# EasyEDA schematic hextech-mechahand.json
TITLE: 6 PID Driver; REV: 1.0; Date: 2019-07-25; Sheet: 1/1; Drawn By: Calin; Company: Motarelu
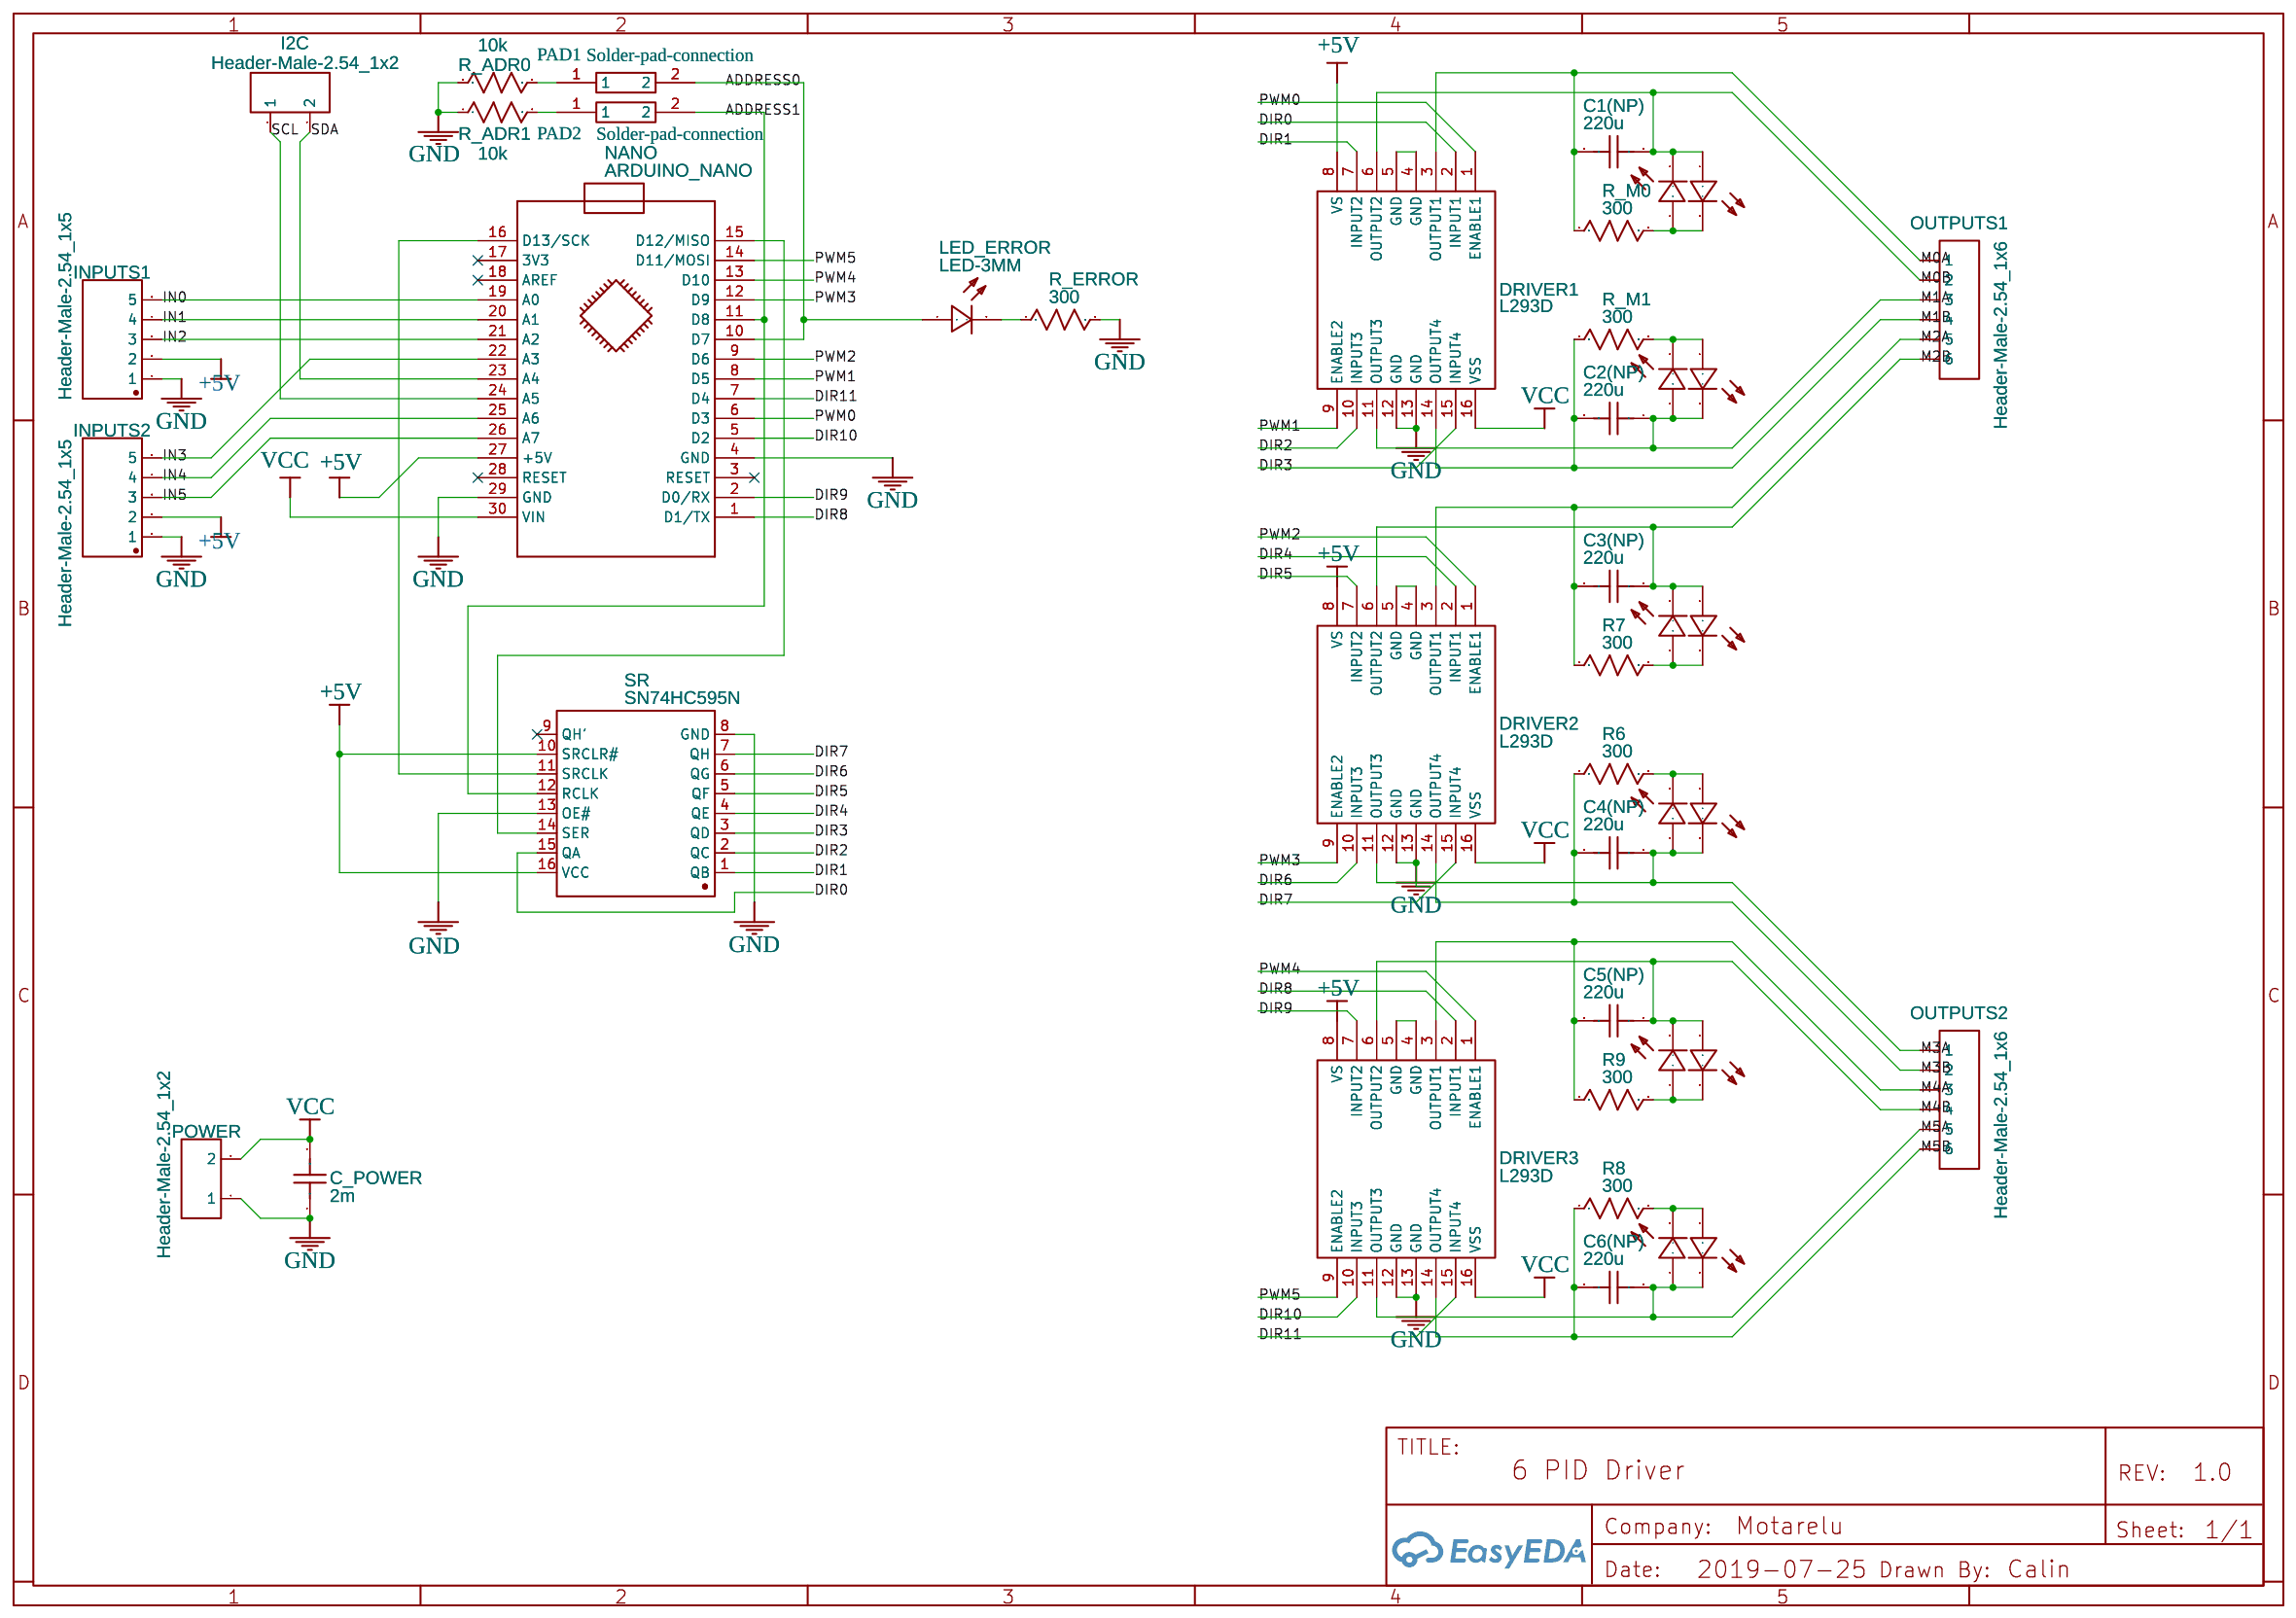
[diagram p0: schematic sheet]

## Parts
C1(NP)  220u  [RAD-0.1]
C2(NP)  220u  [RAD-0.1]
C3(NP)  220u  [RAD-0.1]
C4(NP)  220u  [RAD-0.1]
C5(NP)  220u  [RAD-0.1]
C6(NP)  220u  [RAD-0.1]
C_POWER  2m  [RAD-0.1]
DRIVER1  L293D  [DIP-16]
DRIVER2  L293D  [DIP-16]
DRIVER3  L293D  [DIP-16]
I2C  Header-Male-2.54_1x2  [HDR-2X1/2.54]
INPUTS1  Header-Male-2.54_1x5  [DIP-1X5P-2.54MM-M]
INPUTS2  Header-Male-2.54_1x5  [DIP-1X5P-2.54MM-M]
LED_ERROR  LED-3MM  [LED-3MM/2.54]
LED_M0A  LED-3MM  [LED-3MM/2.54]
LED_M0B  LED-3MM  [LED-3MM/2.54]
LED_M1A  LED-3MM  [LED-3MM/2.54]
LED_M1B  LED-3MM  [LED-3MM/2.54]
LED_M2A  LED-3MM  [LED-3MM/2.54]
LED_M2B  LED-3MM  [LED-3MM/2.54]
LED_M3A  LED-3MM  [LED-3MM/2.54]
LED_M3B  LED-3MM  [LED-3MM/2.54]
LED_M4A  LED-3MM  [LED-3MM/2.54]
LED_M4B  LED-3MM  [LED-3MM/2.54]
LED_M5A  LED-3MM  [LED-3MM/2.54]
LED_M5B  LED-3MM  [LED-3MM/2.54]
NANO  ARDUINO_NANO  [ARDUINO_NANO]
OUTPUTS1  Header-Male-2.54_1x6  [HDR-6X1/2.54]
OUTPUTS2  Header-Male-2.54_1x6  [HDR-6X1/2.54]
PAD1  Solder-pad-connection  [PAD SHUNT]
PAD2  Solder-pad-connection  [PAD SHUNT]
POWER  Header-Male-2.54_1x2  [HDR-2X1/2.54]
R6  300  [AXIAL-0.3]
R7  300  [AXIAL-0.3]
R8  300  [AXIAL-0.3]
R9  300  [AXIAL-0.3]
R_ADR0  10k  [AXIAL-0.3]
R_ADR1  10k  [AXIAL-0.3]
R_ERROR  300  [AXIAL-0.3]
R_M0  300  [AXIAL-0.3]
R_M1  300  [AXIAL-0.3]
SR  SN74HC595N  [DIP-16]

## Library data of the parts
C1(NP) C2(NP) C3(NP) C4(NP) C5(NP) C6(NP) C_POWER = Cap_RAD-0.1_US: Manufacturer Part: ?
DRIVER1-DRIVER3 = -: Contributor: pitreluc; Supplier: LCSC; Manufacturer: STMicroelectronics; image: //image.lceda.cn/szlcsc/C12340.jpg; Supplier Part: C12340
I2C POWER = -: Supplier: LCSC; Manufacturer: TE Connectivity; Manufacturer Part: 826629-2; image: //image.lceda.cn/szlcsc/C86471.jpg; Supplier Part: C86471
INPUTS1 INPUTS2 = -: Supplier: LCSC; Manufacturer: Ckmtw; Manufacturer Part: 210S-1*5P L=11.6MMGold-plated black; Contributor: LCSC; Supplier Part: C124379
LED_ERROR LED_M0A LED_M0B LED_M1A LED_M1B LED_M2A LED_M2B LED_M3A LED_M3B LED_M4A LED_M4B LED_M5A LED_M5B = -: Supplier: LCSC; Manufacturer: EVERLIGHT; Manufacturer Part: 204-10SURD/S530-A3; Supplier Part: C99772
NANO = -: sourceId: KGSeAWhDB; Manufacturer Part: ?
OUTPUTS1 OUTPUTS2 = -: Supplier: LCSC; Manufacturer: BOOMELE; Supplier Part: C37208
R6-R9 R_ADR0 R_ADR1 R_ERROR R_M0 R_M1 = Res_AXIAL-0.3(1/8W)_US: Manufacturer Part: ?
SR = -: Supplier: LCSC; Manufacturer: TI; image: //image.lceda.cn/szlcsc/C78711.jpg; Supplier Part: C78711

## Nets
+5V: DRIVER1.8(VS) DRIVER2.8(VS) DRIVER3.8(VS) INPUTS1.2 INPUTS2.2 NANO.27(+5V) SR.10(SRCLR#) SR.16(VCC)
GND: C_POWER.1 DRIVER1.12(GND) DRIVER1.13(GND) DRIVER2.12(GND) DRIVER2.13(GND) DRIVER3.12(GND) DRIVER3.13(GND) INPUTS1.1 INPUTS2.1 NANO.4(GND) NANO.29(GND) POWER.1 R_ADR0.1 R_ADR1.1 R_ERROR.2 SR.8(GND) SR.13(OE#)
VCC: C_POWER.2 DRIVER1.16(VSS) DRIVER2.16(VSS) DRIVER3.16(VSS) NANO.30(VIN) POWER.2
ADDRESS0: LED_ERROR.1(+) NANO.10(D7) PAD1.2
ADDRESS1: NANO.11(D8) PAD2.2 SR.12(RCLK)
DIR0: DRIVER1.2(INPUT1) SR.15(QA)
DIR1: DRIVER1.7(INPUT2) SR.1(QB)
DIR2: DRIVER1.10(INPUT3) SR.2(QC)
DIR3: DRIVER1.15(INPUT4) SR.3(QD)
DIR4: DRIVER2.2(INPUT1) SR.4(QE)
DIR5: DRIVER2.7(INPUT2) SR.5(QF)
DIR6: DRIVER2.10(INPUT3) SR.6(QG)
DIR7: DRIVER2.15(INPUT4) SR.7(QH)
DIR8: DRIVER3.2(INPUT1) NANO.1(D1/TX)
DIR9: DRIVER3.7(INPUT2) NANO.2(D0/RX)
DIR10: DRIVER3.10(INPUT3) NANO.5(D2)
DIR11: DRIVER3.15(INPUT4) NANO.7(D4)
IN0: INPUTS1.5 NANO.19(A0)
IN1: INPUTS1.4 NANO.20(A1)
IN2: INPUTS1.3 NANO.21(A2)
IN3: INPUTS2.5 NANO.22(A3)
IN4: INPUTS2.4 NANO.25(A6)
IN5: INPUTS2.3 NANO.26(A7)
M0A: C1(NP).2 DRIVER1.3(OUTPUT1) OUTPUTS1.1 R_M0.1
M0B: C1(NP).1 DRIVER1.6(OUTPUT2) LED_M0A.2(-) LED_M0B.1(+) OUTPUTS1.2
M1A: C2(NP).1 DRIVER1.11(OUTPUT3) LED_M1A.1(+) LED_M1B.2(-) OUTPUTS1.3
M1B: C2(NP).2 DRIVER1.14(OUTPUT4) OUTPUTS1.4 R_M1.1
M2A: C3(NP).2 DRIVER2.3(OUTPUT1) OUTPUTS1.5 R7.1
M2B: C3(NP).1 DRIVER2.6(OUTPUT2) LED_M2A.2(-) LED_M2B.1(+) OUTPUTS1.6
M3A: C4(NP).1 DRIVER2.11(OUTPUT3) LED_M3A.1(+) LED_M3B.2(-) OUTPUTS2.1
M3B: C4(NP).2 DRIVER2.14(OUTPUT4) OUTPUTS2.2 R6.1
M4A: C5(NP).2 DRIVER3.3(OUTPUT1) OUTPUTS2.3 R9.1
M4B: C5(NP).1 DRIVER3.6(OUTPUT2) LED_M4A.2(-) LED_M4B.1(+) OUTPUTS2.4
M5A: C6(NP).1 DRIVER3.11(OUTPUT3) LED_M5A.1(+) LED_M5B.2(-) OUTPUTS2.5
M5B: C6(NP).2 DRIVER3.14(OUTPUT4) OUTPUTS2.6 R8.1
PWM0: DRIVER1.1(ENABLE1) NANO.6(D3)
PWM1: DRIVER1.9(ENABLE2) NANO.8(D5)
PWM2: DRIVER2.1(ENABLE1) NANO.9(D6)
PWM3: DRIVER2.9(ENABLE2) NANO.12(D9)
PWM4: DRIVER3.1(ENABLE1) NANO.13(D10)
PWM5: DRIVER3.9(ENABLE2) NANO.14(D11/MOSI)
SCL: I2C.1 NANO.24(A5)
SDA: I2C.2 NANO.23(A4)
Net-(DRIVER1-4): DRIVER1.4(GND) DRIVER1.5(GND)
Net-(DRIVER2-4): DRIVER2.4(GND) DRIVER2.5(GND)
Net-(DRIVER3-4): DRIVER3.4(GND) DRIVER3.5(GND)
Net-(LED_ERROR-2): LED_ERROR.2(-) R_ERROR.1
Net-(LED_M0A-1): LED_M0A.1(+) LED_M0B.2(-) R_M0.2
Net-(LED_M1A-2): LED_M1A.2(-) LED_M1B.1(+) R_M1.2
Net-(LED_M2A-1): LED_M2A.1(+) LED_M2B.2(-) R7.2
Net-(LED_M3A-2): LED_M3A.2(-) LED_M3B.1(+) R6.2
Net-(LED_M4A-1): LED_M4A.1(+) LED_M4B.2(-) R9.2
Net-(LED_M5A-2): LED_M5A.2(-) LED_M5B.1(+) R8.2
Net-(NANO-15): NANO.15(D12/MISO) SR.14(SER)
Net-(NANO-16): NANO.16(D13/SCK) SR.11(SRCLK)
Net-(PAD1-1): PAD1.1 R_ADR0.2
Net-(PAD2-1): PAD2.1 R_ADR1.2

Not connected (* = marked no-connect by the designer): NANO 3(RESET)* 17(3V3)* 18(AREF)* 28(RESET)*; SR 9(QH')*
